# EasyEDA schematic IOT_proje.json
TITLE: Akıllı ev IOT sistemi; REV: 1.0; Date: 2019-12-31; Sheet: 1/1; Drawn By: Uğur Yavaş; Company: Ugur Yavas
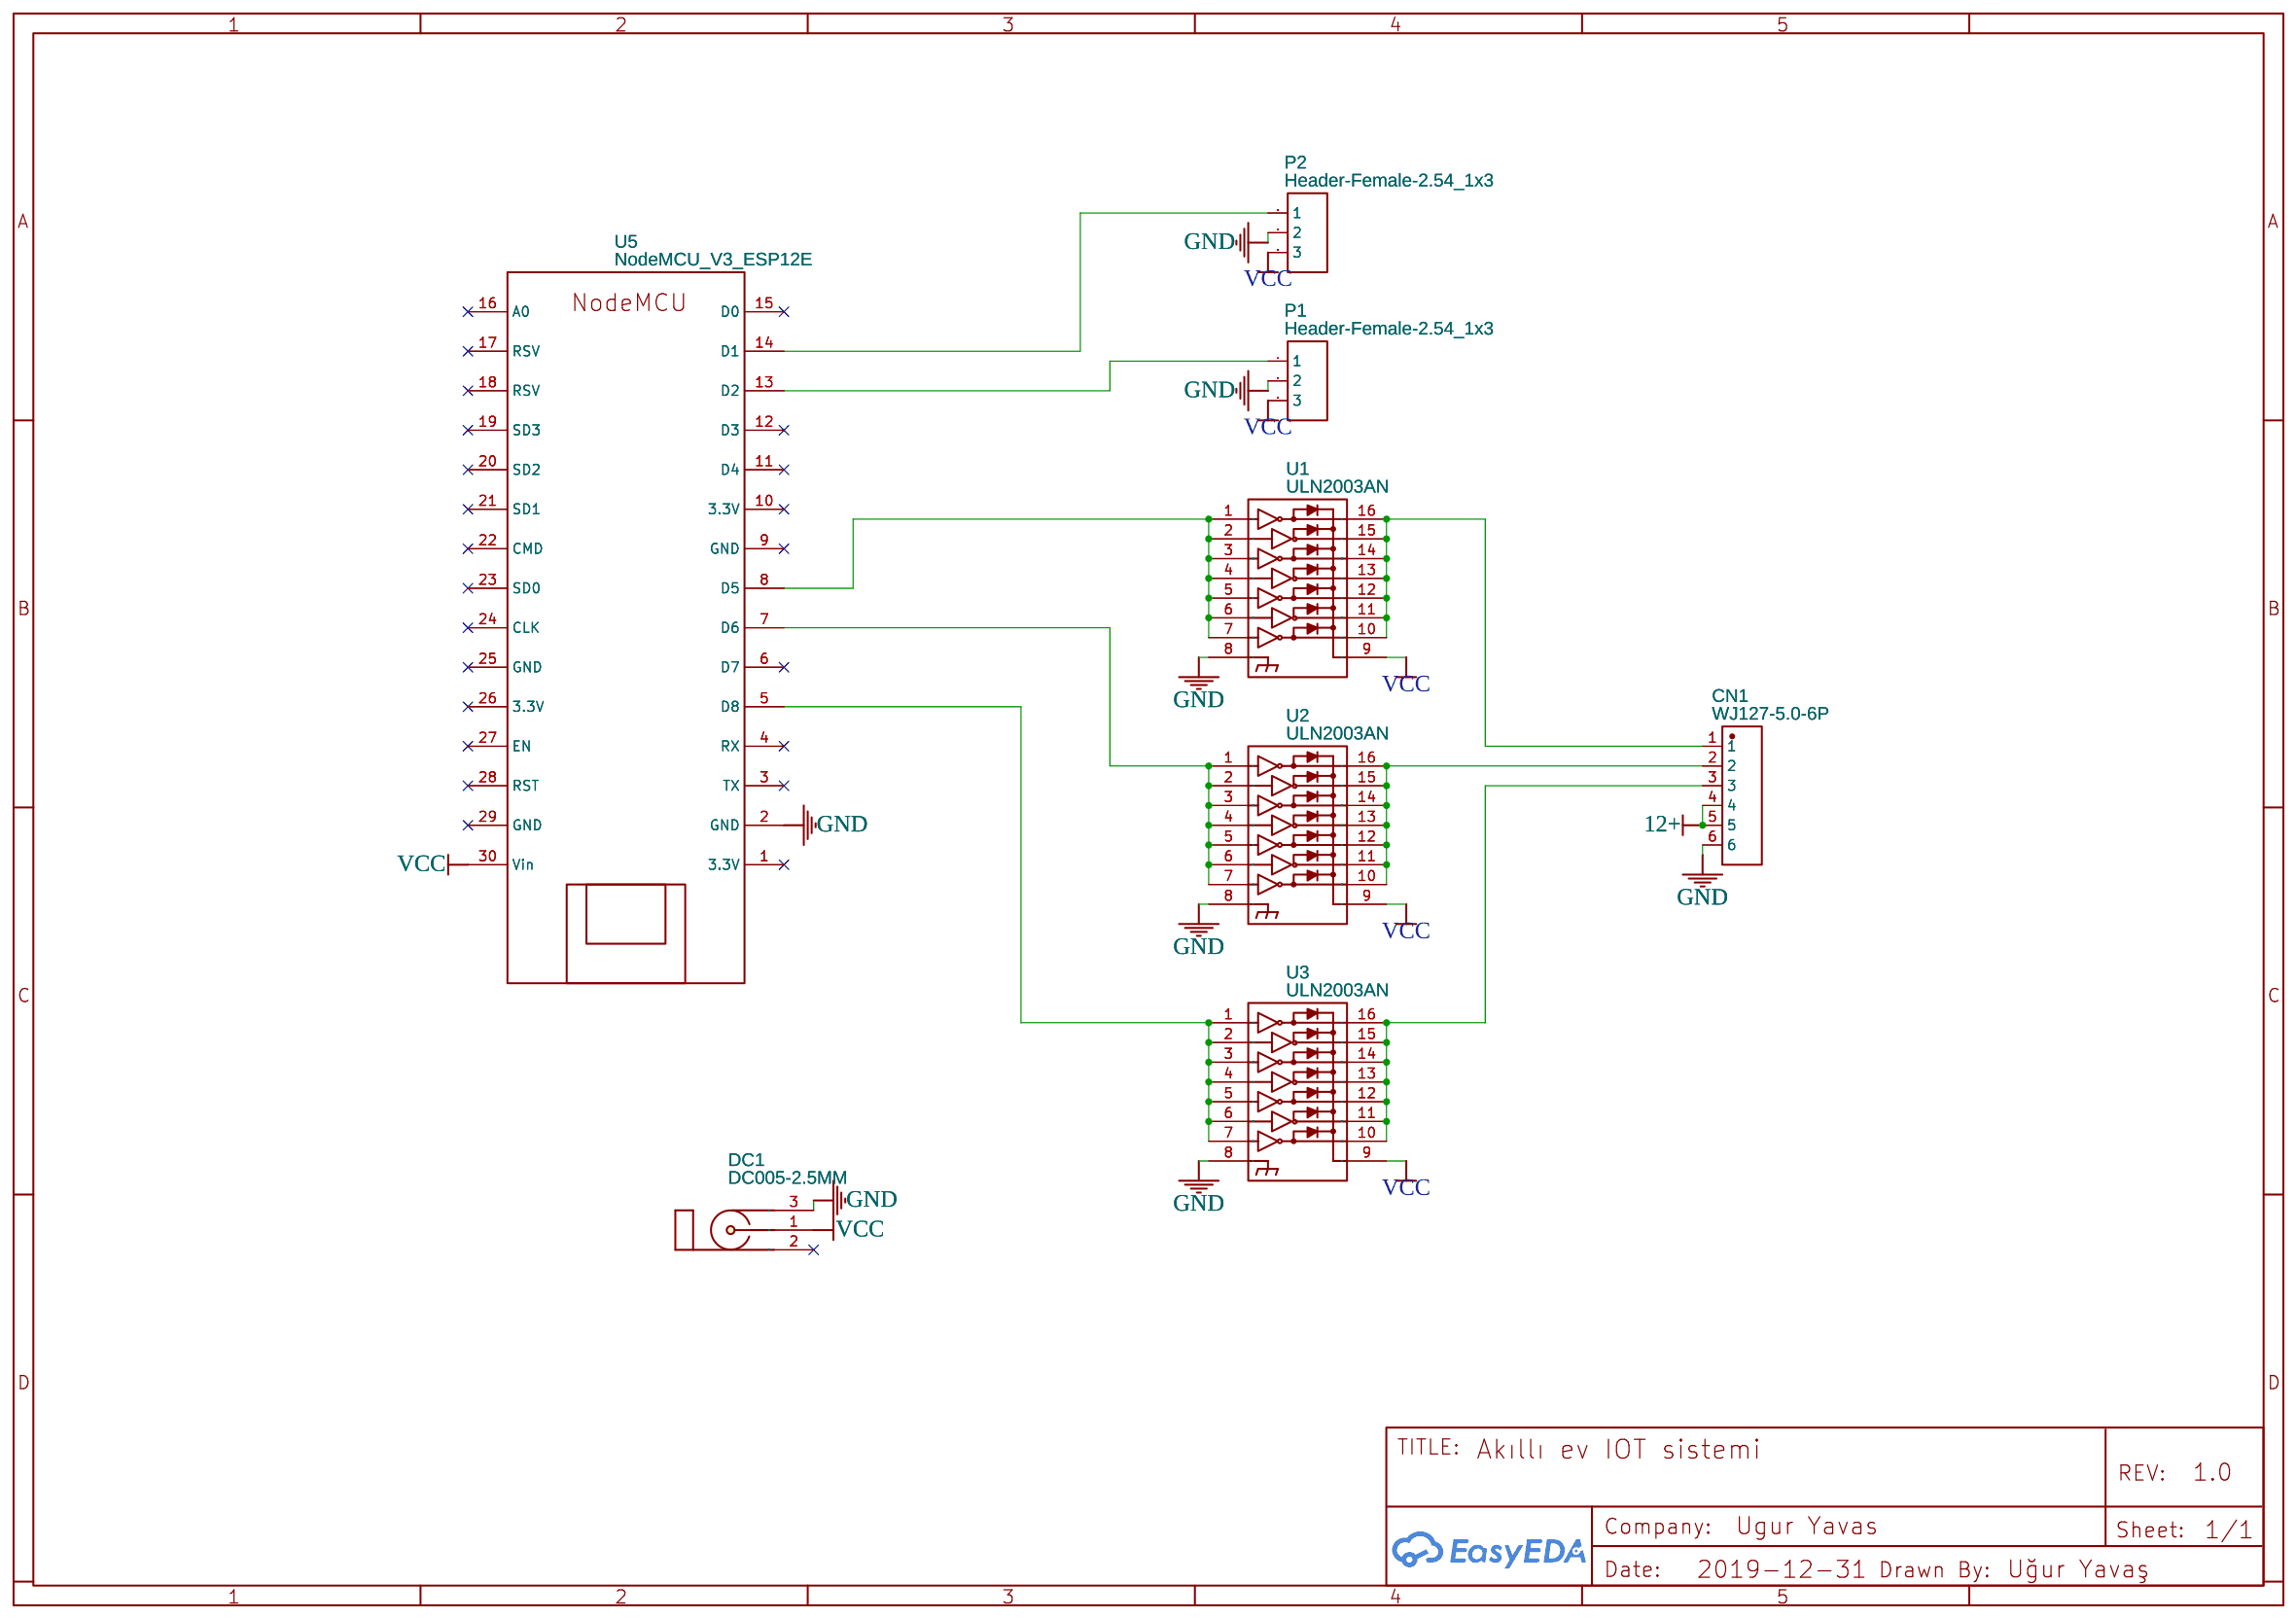
[diagram p0: schematic sheet]

## Parts
CN1  WJ127-5.0-6P  [CONN-TH_6P-P5.00_WJ127-5.0-6P]
DC1  DC005-2.5MM  [DC-IN-TH_DC-005-20A]
P1  Header-Female-2.54_1x3  [HDR-TH_3P-P2.54-V]
P2  Header-Female-2.54_1x3  [HDR-TH_3P-P2.54-V]
U1  ULN2003AN  [DIP-16_16PIN-LS7.62-L19.69-W6.60-PITCH2.54]
U2  ULN2003AN  [DIP-16_16PIN-LS7.62-L19.69-W6.60-PITCH2.54]
U3  ULN2003AN  [DIP-16_16PIN-LS7.62-L19.69-W6.60-PITCH2.54]
U5  NodeMCU_V3_ESP12E  [MODEMCU_ESP32S]

## Library data of the parts
CN1 = WJ127-5.0-6P: Supplier: LCSC; Supplier Part: C192781; Manufacturer: Ningbo Kangnex Elec; Contributor: LCSC
DC1 = DC005-2.5MM: Supplier: LCSC; Manufacturer: SOFNG; Supplier Part: C111573
P1 P2 = Header-Female-2.54_1x3: Supplier Part: C146243; Supplier: LCSC; Manufacturer: Boom Precision Elec; link: https://datasheet.lcsc.com/szlcsc/Boom-Precision-Elec-2-54mm-1-8P-Straight-Female-header_C27438.pdf
U1-U3 = ULN2003AN: Supplier: LCSC; Manufacturer: TI; Supplier Part: C90448
U5 = NodeMCU_V1_ESP12E: catid: 20; Contributor: canda410; sourceId: OGtr1ZXUS; Manufacturer Part: ?

## Nets
GND: CN1.6 DC1.3 P1.2 P2.2 U1.8(E) U2.8(E) U3.8(E) U5.2(GND)
VCC: DC1.1(VCC) P1.3 P2.3 U1.9(COM) U2.9(COM) U3.9(COM) U5.30(Vin)
12+: CN1.4 CN1.5
Net-(CN1-1): CN1.1 U1.10(7C) U1.11(6C) U1.12(5C) U1.13(4C) U1.14(3C) U1.15(2C) U1.16(1C)
Net-(CN1-2): CN1.2 U2.10(7C) U2.11(6C) U2.12(5C) U2.13(4C) U2.14(3C) U2.15(2C) U2.16(1C)
Net-(CN1-3): CN1.3 U3.10(7C) U3.11(6C) U3.12(5C) U3.13(4C) U3.14(3C) U3.15(2C) U3.16(1C)
Net-(P1-1): P1.1 U5.13(D2)
Net-(P2-1): P2.1 U5.14(D1)
Net-(U1-1): U1.1(1B) U1.2(2B) U1.3(3B) U1.4(4B) U1.5(5B) U1.6(6B) U1.7(7B) U5.8(D5)
Net-(U2-1): U2.1(1B) U2.2(2B) U2.3(3B) U2.4(4B) U2.5(5B) U2.6(6B) U2.7(7B) U5.7(D6)
Net-(U3-1): U3.1(1B) U3.2(2B) U3.3(3B) U3.4(4B) U3.5(5B) U3.6(6B) U3.7(7B) U5.5(D8)

Not connected (* = marked no-connect by the designer): DC1 2*; U5 1(3.3V)* 3(TX)* 4(RX)* 6(D7)* 9(GND)* 10(3.3V)* 11(D4)* 12(D3)* 15(D0)* 16(A0)* 17(RSV)* 18(RSV)* 19(SD3)* 20(SD2)* 21(SD1)* 22(CMD)* 23(SD0)* 24(CLK)* 25(GND)* 26(3.3V)* 27(EN)* 28(RST)* 29(GND)*
